# EAGLE design Pote_V1.0 (EAGLE 9.4.1)
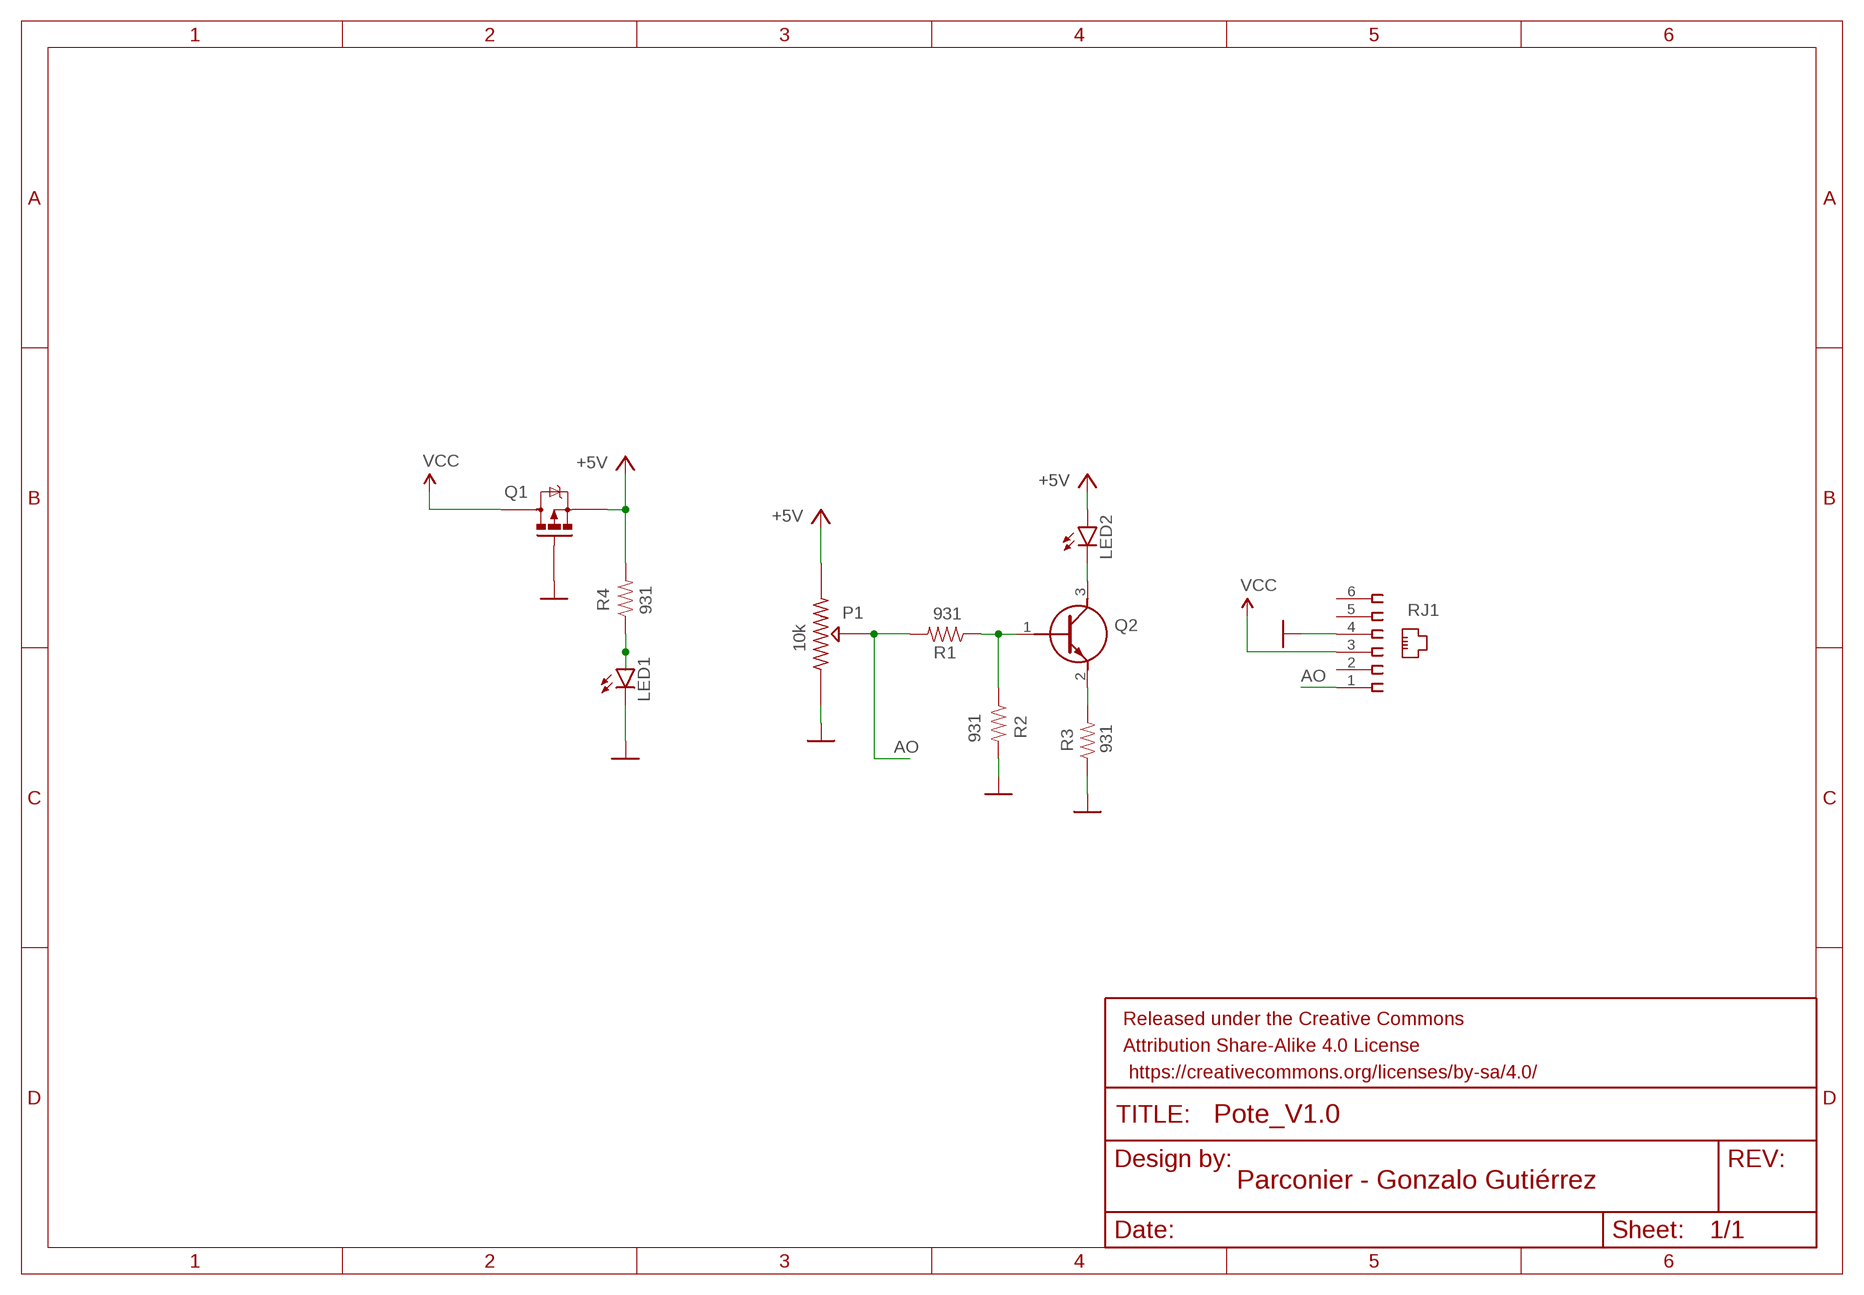
[diagram p0: schematic, sheet 1]

## Parts
LED1  LED0603  [LED-0603]
LED2  LED0603  [LED-0603]
P1  10k  PTV09A-2015F-B103  [PTV09A-2015F]
Q1  RU1C002ZPTCL  [SOTFL65P210X105-3N]
Q2  MMBT3904,215  [SOT95P230X110-3N]
R1  931  RES_0402  [RESC1005X35]
R2  931  RES_0402  [RESC1005X35]
R3  931  RES_0402  [RESC1005X35]
R4  931  RES_0402  [RESC1005X35]
RJ1  615006138421  [615006138421]

## Nets
+5V: LED2.A P1.3(R_2) Q1.2(S) R4.2
AO: P1.2(WIPER) R1.2 RJ1.1
GND: LED1.C P1.1(R_1) Q1.1(G) R2.2 R3.1 RJ1.4
N$1: Q2.2(E) R3.2
N$2: LED2.C Q2.3(C)
N$3: Q2.1(B) R1.1 R2.1
N$5: LED1.A R4.1
VCC: Q1.3(D) RJ1.3
Unconnected: RJ1.2 RJ1.5 RJ1.6

## Library data of the parts
LED1 = SparkFun-LED:LED: LEDs Standard schematic elements and footprints for 5mm, 3mm, 1206, and 0603 sized LEDs. 5mm - Spark Fun Electronics SKU : COM-00529 (and others); MPN: LTST-C193KRKT-5A
LED2 = SparkFun-LED:LED: LEDs Standard schematic elements and footprints for 5mm, 3mm, 1206, and 0603 sized LEDs. 5mm - Spark Fun Electronics SKU : COM-00529 (and others); MPN: LB Q39E-L2OO-35-1
P1 = PTV09A-2015F-B103:PTV09A-2015F-B103: Bourns Potentiometer PTV Series with a 6 mm Dia. Shaft 10k +/-20% 0.05W, Linear, Through Hole Source: Datasheet <https://componentsearchengine.com/Datasheets/2/PTV09A-2015F-B103.pdf>; ALLIED_NUMBER: 70407922; ALLIED_PRICE-STOCK: https://www.alliedelec.com/bourns-ptv09a-2015f-b103/70407922/; DESCRIPTION: Bourns Potentiometer PTV Series with a 6 mm Dia. Shaft 10k +/-20% 0.05W, Linear, Through Hole; HEIGHT: mm; MANUFACTURER_NAME: Bourns; MANUFACTURER_PART_NUMBER: PTV09A-2015F-B103; MOUSER_PART_NUMBER: 652-PTV09A-2015FB103; MOUSER_PRICE-STOCK: https://www.mouser.com/Search/Refine.aspx?Keyword=652-PTV09A-2015FB103; MPN: PTV09A-2025F-B103; RS_PART_NUMBER: 7377818P; RS_PRICE-STOCK: http://uk.rs-online.com/web/p/products/7377818P
Q1 = RU1C002ZPTCL:RU1C002ZPTCL: ROHM - RU1C002ZPTCL - MOSFET, P-CH, -20V, -0.2A, SOT-323FL Source: Datasheet <https://componentsearchengine.com/Datasheets/2/RU1C002ZPTCL.pdf>; ARROW_PART_NUMBER: RU1C002ZPTCL; DESCRIPTION: ROHM - RU1C002ZPTCL - MOSFET, P-CH, -20V, -0.2A, SOT-323FL; HEIGHT: 1.05mm; MANUFACTURER_NAME: ROHM Semiconductor; MANUFACTURER_PART_NUMBER: RU1C002ZPTCL; MPN: RU1C002ZPTCL
Q2 = MMBT3904_215:MMBT3904,215: MMBT3904 - NPN switching transistor Source: Datasheet <http://assets.nexperia.com/documents/data-sheet/MMBT3904.pdf>; DESCRIPTION: MMBT3904 - NPN switching transistor; HEIGHT: 1.1mm; MANUFACTURER_NAME: Nexperia; MANUFACTURER_PART_NUMBER: MMBT3904,215; MOUSER_PART_NUMBER: 771-MMBT3904T/R; MOUSER_PRICE-STOCK: https://www.mouser.com/Search/Refine.aspx?Keyword=771-MMBT3904T%2FR; MPN: MMBT3904,215; RS_PART_NUMBER: 1791079; RS_PRICE-STOCK: http://uk.rs-online.com/web/p/products/1791079
R1-R4 = Perfect_0402:RES_0402; MPN: RC0402FR-07931RL
RJ1 = 615006138421:615006138421: HORIZONTAL PLASTIC 6P6C MODULAR JACK TAP UP Source: Datasheet <http://docs-europe.electrocomponents.com/webdocs/0f88/0900766b80f88670.pdf>; DESCRIPTION: HORIZONTAL PLASTIC 6P6C MODULAR JACK TAP UP; HEIGHT: mm; MANUFACTURER_NAME: W&uuml;rth Elektronik; MANUFACTURER_PART_NUMBER: 615006138421; MPN: 615006138421; RS_PART_NUMBER: 7350282; SUPPLIER_NAME: RS

## Board
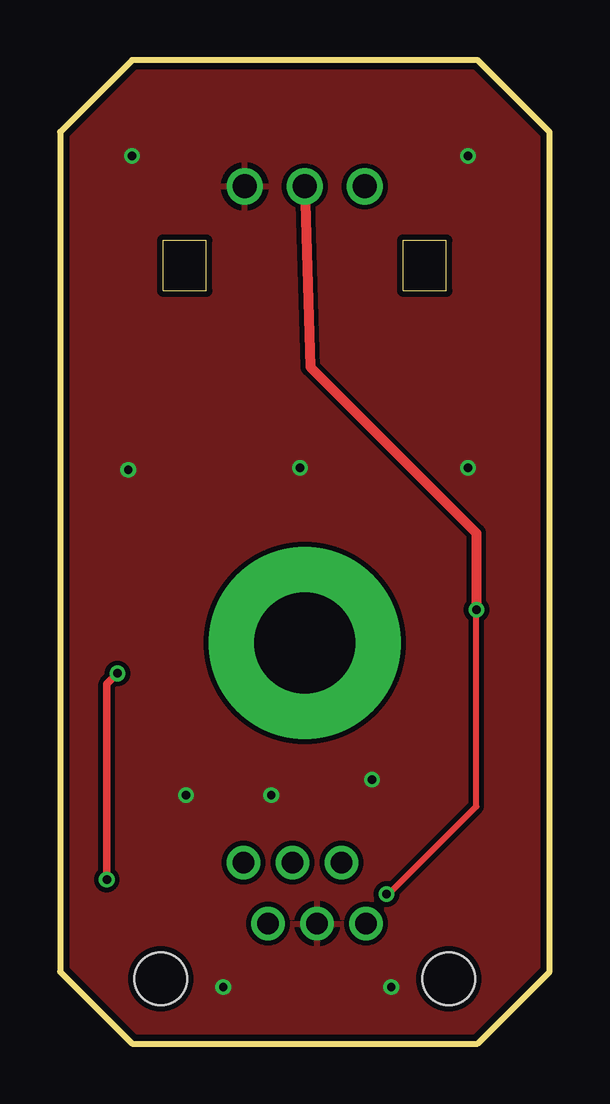
[diagram p1: board, top side]
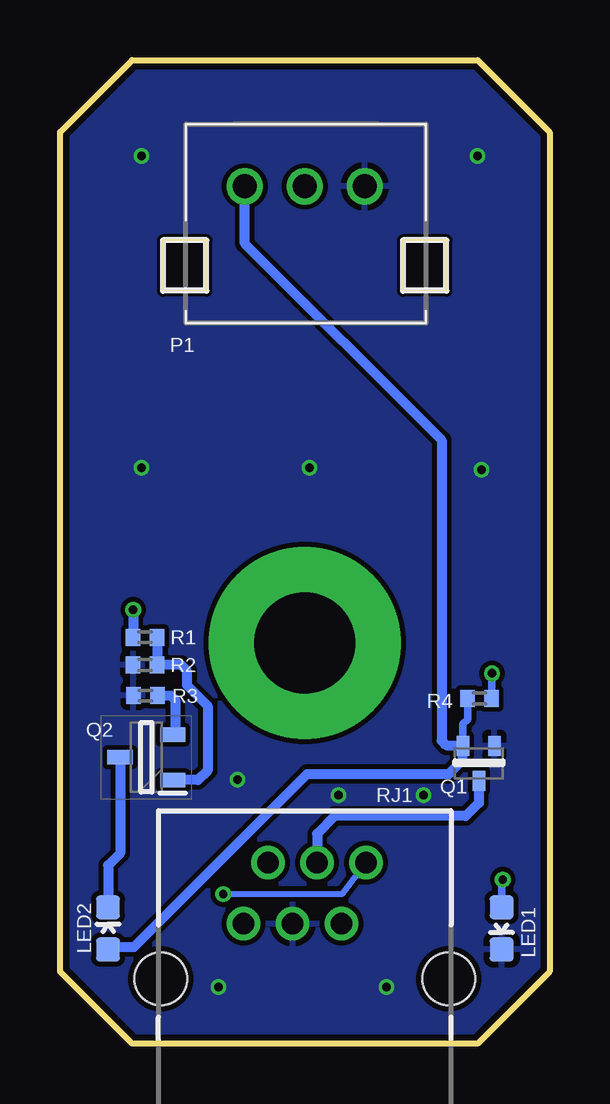
[diagram p2: board, bottom side, seen from below]

Size 20.4 x 41 mm. Coordinates in mm from the lower left corner, seen from the top.
Outline: 0,38 0,3 3,0 17.4,0 20.4,3 20.4,38 17.4,41 3,41 0,38
Copper layers (1*16): Top 0.035mm / dielectric 1.5mm / Bottom 0.035mm
Design rules "SeeedStudio_2layer_DRU_no_angle_20140221": minimum track width 6mil, minimum drill 12mil, track to track 6mil, track to pad 6mil, pad to pad 6mil, via to via 6mil, smd to smd 0mil, copper to edge 10mil, drill to drill 10mil, minimum pad ring 10mil, minimum via ring 6mil, stop-mask expansion 2mil, vias tented up to drill 100mil, thermal gap 10mil

### Footprints (pad centres in the part's own frame; a part is rotated, then mirrored left to right if it is on the bottom)
LED-0603 = smd 1 x 1: A 0,-0.877; C 0,0.877
PTV09A-2015F = drill 1 pad 1.5: 1 -2.5,0; 2 0,0; 3 2.5,0
SOTFL65P210X105-3N = smd 0.83 x 0.52: 1 -0.735,0.65; 2 -0.735,-0.65; 3 0.735,0
SOT95P230X110-3N = smd 1.05 x 0.6: 1 -1.1,0.95; 2 -1.1,-0.95; 3 1.1,0
RESC1005X35 = smd 0.6 x 0.7: 1 -0.5,0; 2 0.5,0
615006138421 = drill 0.9 pad 1.4: 1 2.55,4.84; 2 1.53,2.3; 3 0.51,4.84; 4 -0.51,2.3; 5 -1.53,4.84; 6 -2.55,2.3 | hole 2.2: -6,0; 6,0

### Placement (x,y rotation side)
LED1  2,4.8 180 bottom
LED2  18.4,4.8 0 bottom
P1  10.2,35.73 180 bottom
Q1  2.95,11.68 270 bottom
Q2  16.8,11.93 180 bottom
R1  16.85,16.93 180 bottom
R2  16.85,15.78 180 bottom
R3  16.84,14.51 0 bottom
R4  2.92,14.38 180 bottom
RJ1  10.2,2.7 0 bottom

### Tracks (layer width: path | path; a pad name or v marks a point on that pad's centre or on a via)
+5V
  Bottom 0.305: R4.2 3.42,13.51 3.62,13.31 3.62,12.43
  Bottom 0.406: 3.62,12.43 4.3,12.43 4.5,12.63 4.5,25.15 12.7,33.35 P1.3 | 3.62,12.43 Q1.2 | LED2.A 18.3,4.02 17.31,4.02 10.1,11.23 4.2,11.23 3.62,11.81 3.62,12.43
AO  (via drill 0.35)
  Top 0.254: v13.6,6.23 13.7,6.23 17.35,9.88 v17.35,18.08
  Top 0.406: P1.2 10.43,28.2 17.35,21.28 v17.35,18.08
  Bottom 0.254: RJ1.1 8.65,6.23 v13.6,6.23
  Bottom 0.406: v17.35,18.08 R1.2
GND  (via drill 0.35)
  other vias: 3,37 17,37 17,24 2.84,23.92 13,11 5.25,10.35 8.8,10.35 6.8,2.35 13.8,2.35 10,24
  pour Bottom (isolate 0.2): 20.4,41 0,41 0,0 20.4,0
  pour Top (isolate 0.2): 20.4,41 20.4,0 0,0 0,41
N$1
  Bottom 0.406: R3.2 15.78,14.51 15.6,14.33 15.6,12.98 Q2.2
N$2
  Bottom 0.406: Q2.3 17.9,7.93 18.4,7.43 LED2.C
N$3
  Bottom 0.406: R1.1 R2.1 15.35,15.78 15.1,15.53 15.1,14.93 14.25,14.08 14.25,11.38 14.65,10.98 Q2.1
N$5  (via drill 0.35)
  Top 0.305: v1.95,6.83 1.95,14.98 v2.4,15.43
  Bottom 0.305: LED1.A 2,6.78 v1.95,6.83 | v2.4,15.43 2.42,15.41 R4.1
N$6  (via drill 4.2 pad 8)
  other vias: 10.2,16.7
VCC
  Bottom 0.406: Q1.3 2.95,10.03 3.5,9.48 8.95,9.48 9.69,8.74 RJ1.3